# EasyEDA Pro project 1-12.eprj, board PCB2
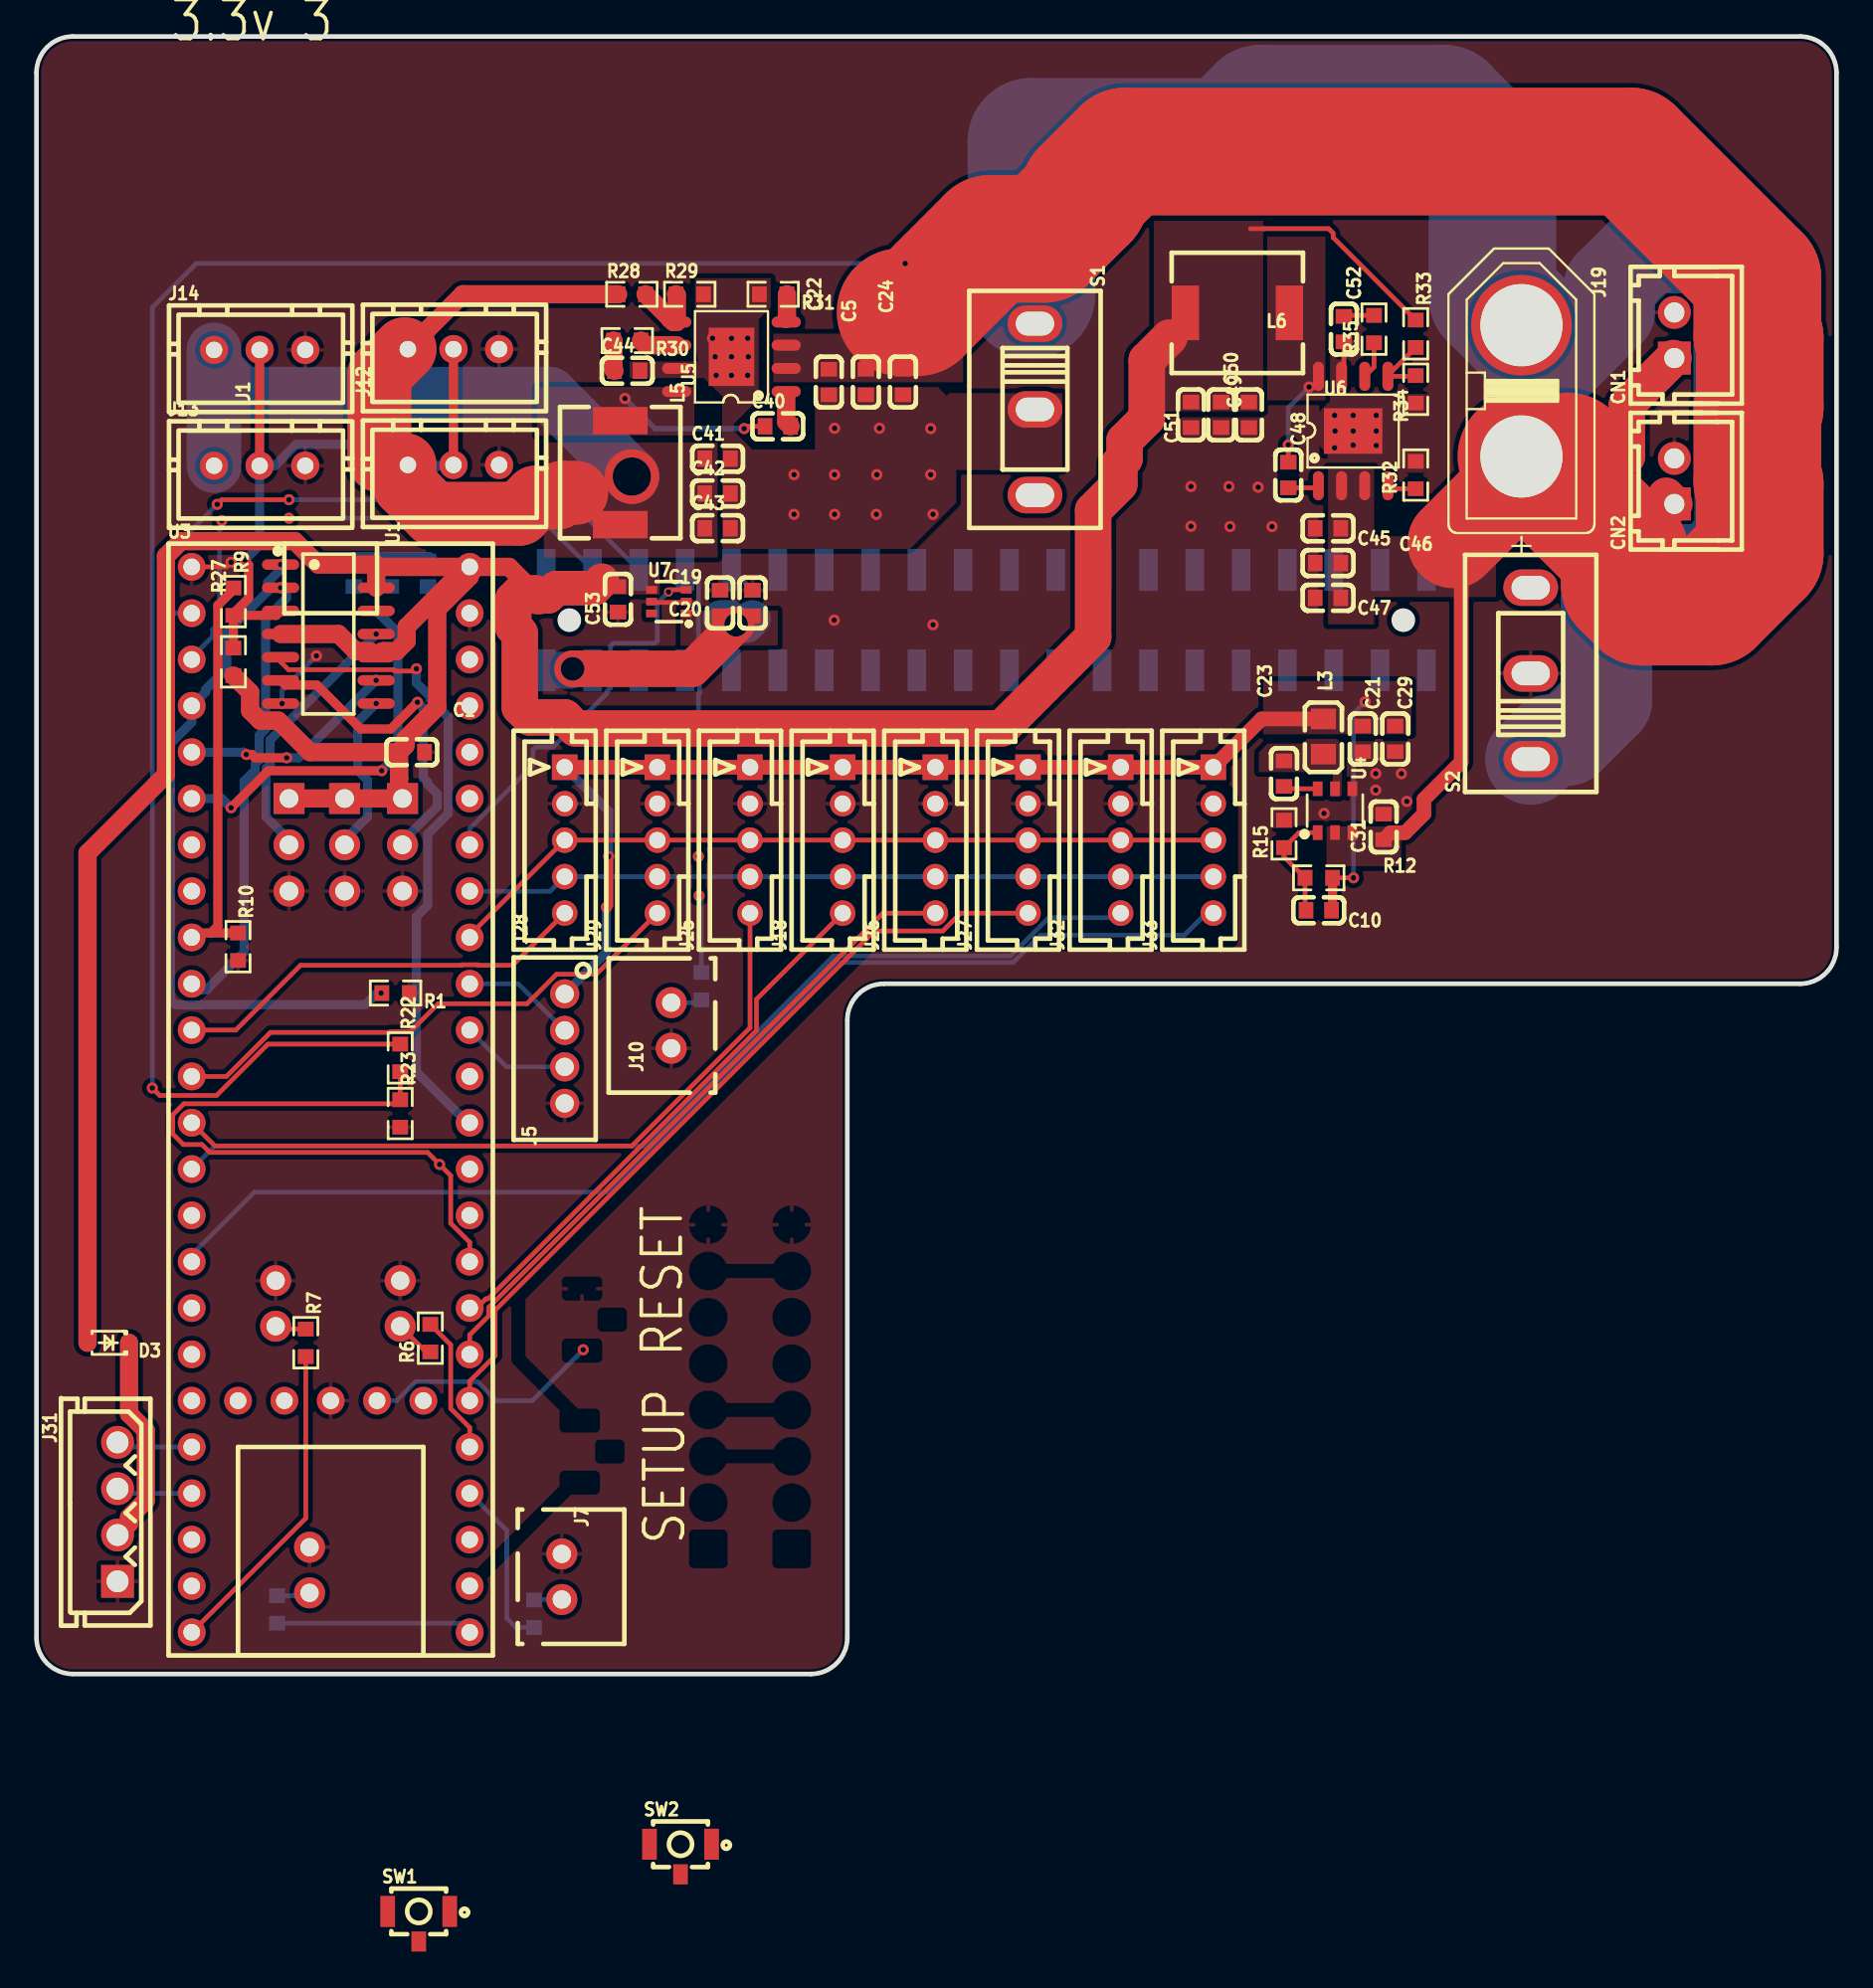
[diagram p1: board, top side]
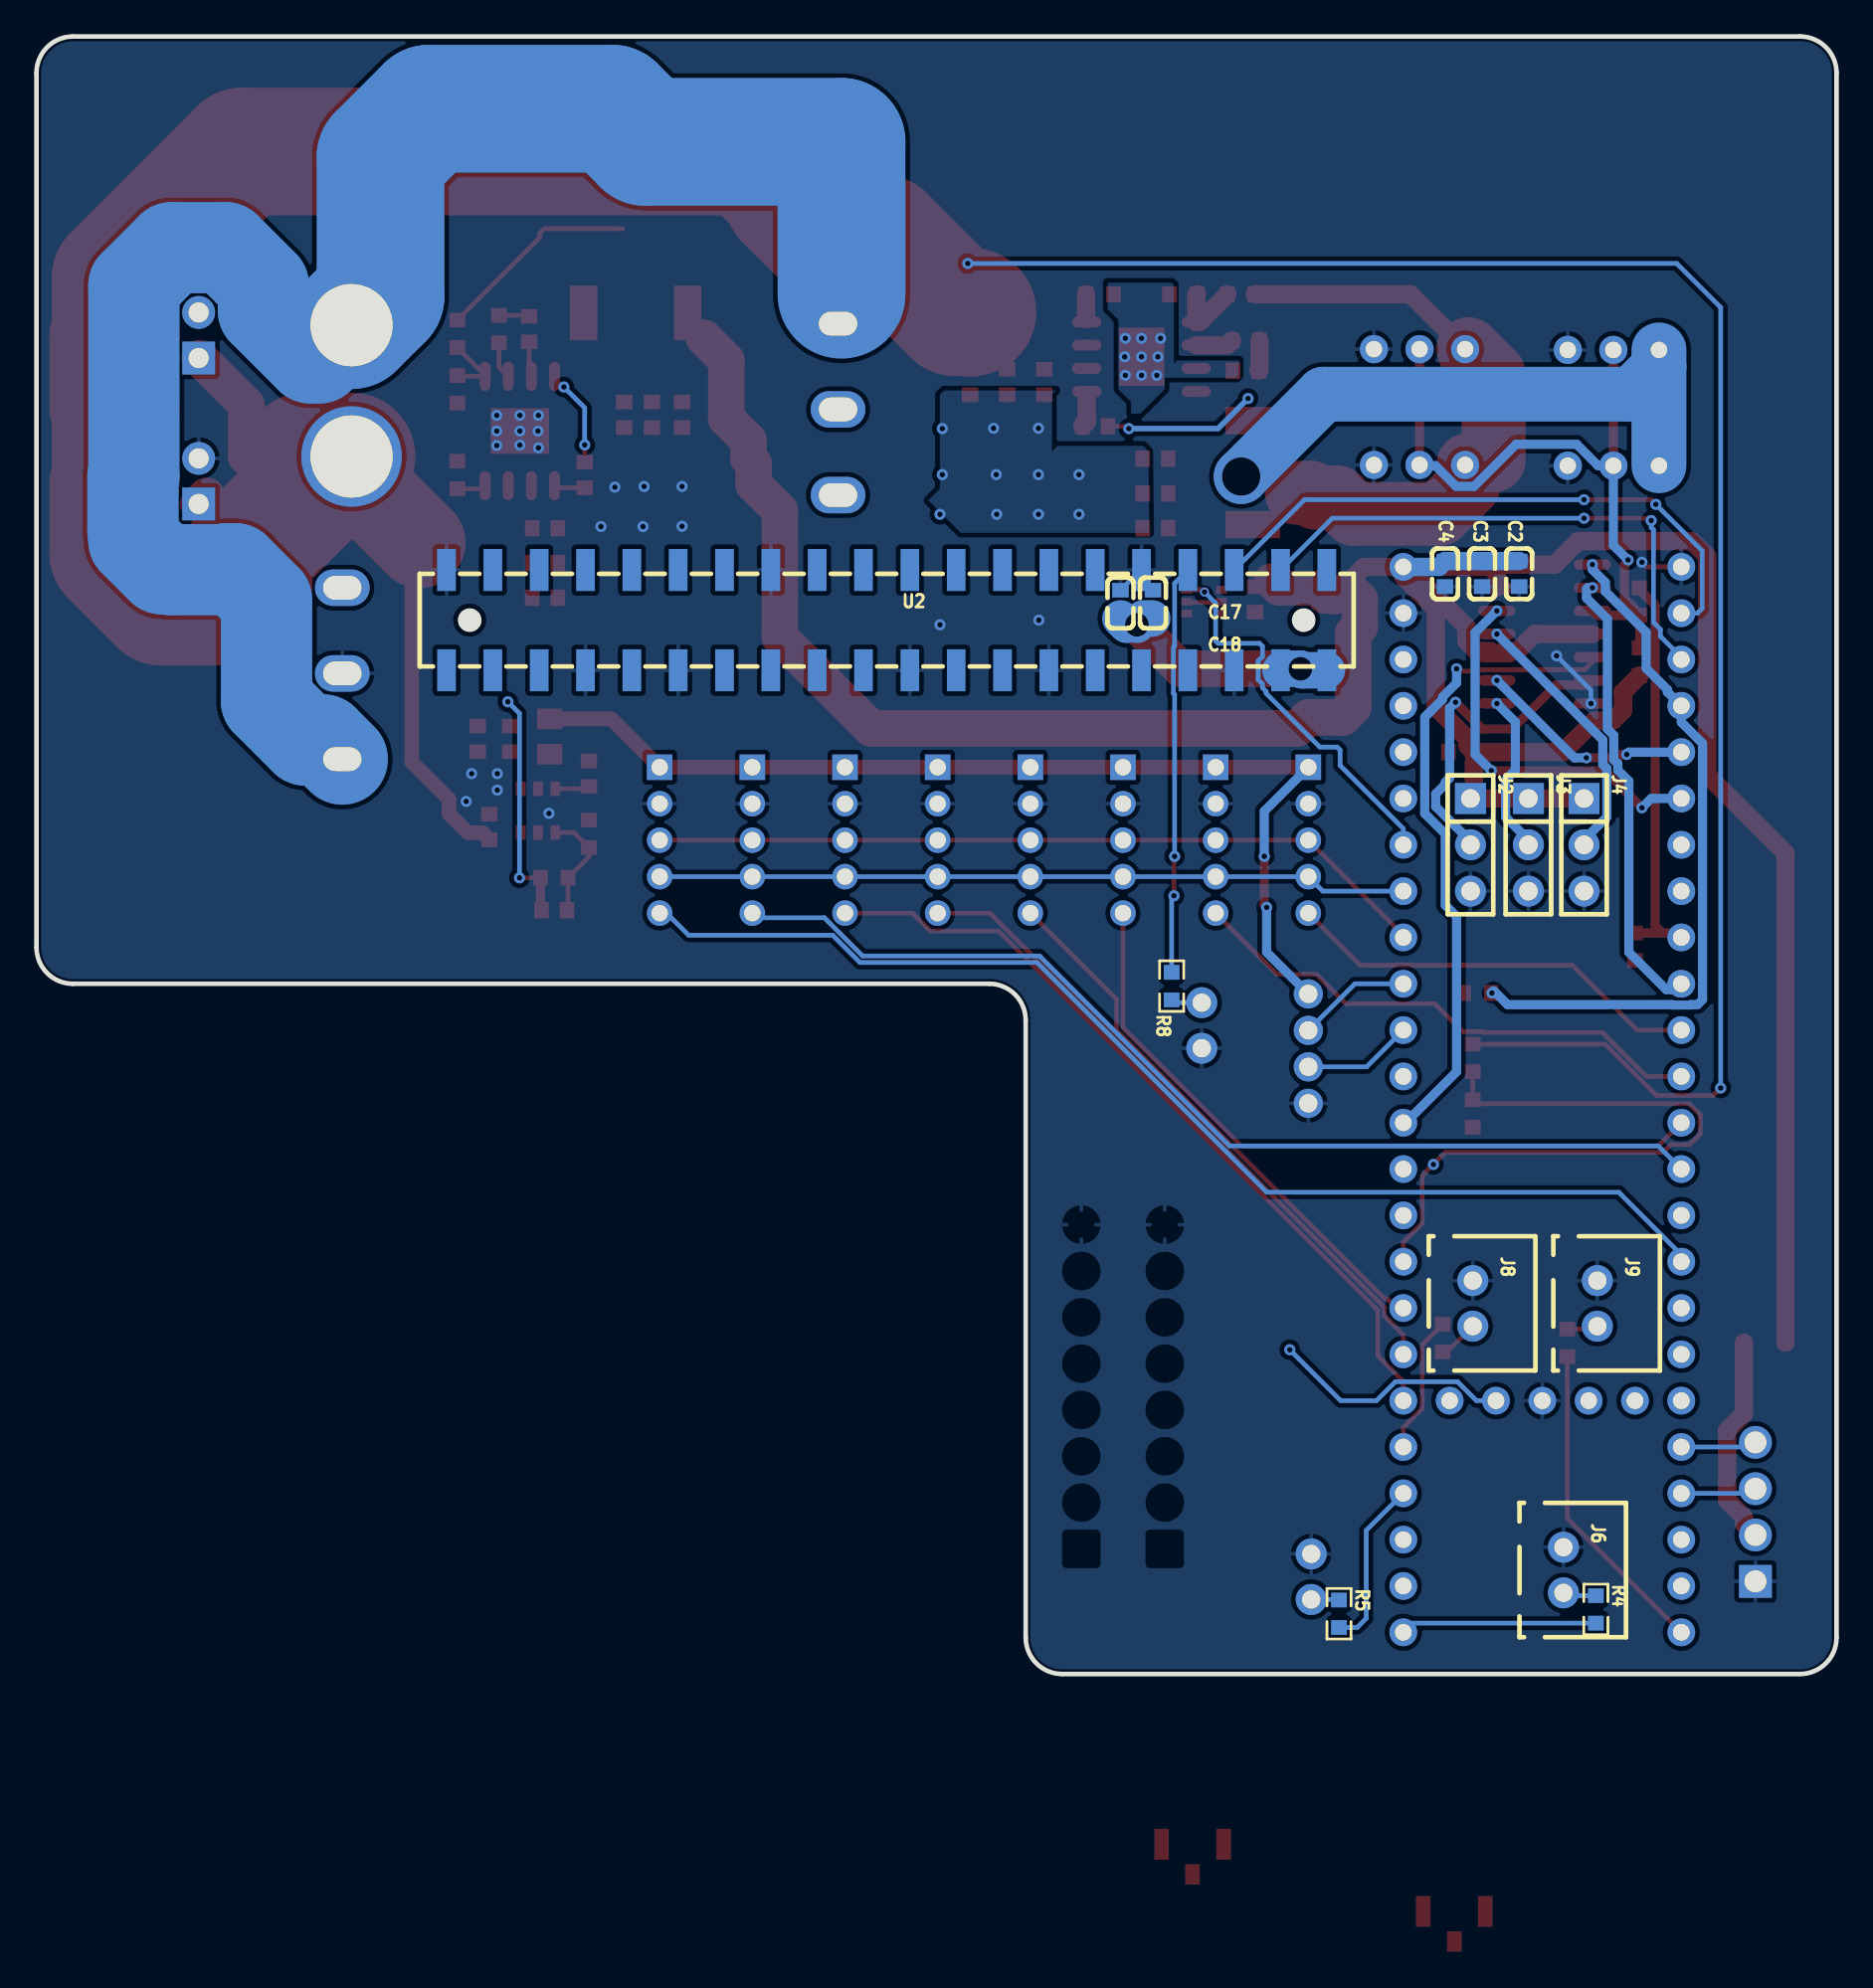
[diagram p2: board, bottom side, seen from below]

Outline 98.68 x 89.79 mm; copper layers: Top Layer, Bottom Layer. Coordinates in mm from the lower left corner of the outline.
Outline path: 0,87.79 0,2 arc(0.59,0.59) 2,0 42.45,0 arc(43.86,0.59) 44.45,2 44.45,35.85 arc(45.04,37.26) 46.45,37.85 96.68,37.85 arc(98.09,38.43) 98.68,39.85 98.68,87.79 arc(98.09,89.2) 96.68,89.79 2,89.79 arc(0.59,89.2) 0,87.79
Stack: Top Layer 0.035mm / Dielectric1 1.51mm FR4 er 4.5 / Bottom Layer 0.035mm

## Design rules (mm)
template: Custom Config
spacing copperThickness1oz (default): track to track 0.102, other pairs 0.152 to 0.3
spacing copperThickness2oz: track to track 0.203, other pairs 0.152 to 0.3
track width copperThickness1oz (default): min 0.127, default 0.254, max 7
track width copperThickness2oz: min 0.203, default 0.254, max 7
differential pair differentialPair (default): width min 0.127, default 0.254, max 2.54; gap min 0.152, default 0.152
via viaSize (default): diameter min 0.5, default 0.61, max 10; hole min 0.3, default 0.305, max 6.3

## Placement (name value [footprint] x y rotation side)
C1  100nF  [C0603]  20.57 50.55 180 top
C2  22uF  [C0603]  17.4 60.33 270 bottom
C3  1uF  [C0603]  19.43 60.33 270 bottom
C4  100nF  [C0603]  21.46 60.33 270 bottom
C5  10uF  [C0603]  45.47 70.84 270 top
C10  100pF  [C0603]  70.3 41.88 180 top
C17  100nF  [C0603]  37.47 58.73 90 bottom
C18  1uF  [C0603]  39.25 58.73 90 bottom
C19  22uF  [C0603]  37.47 58.73 90 top
C20  47uF  [C0603]  39.25 58.73 90 top
C21  22uF  [C0603]  72.71 51.28 270 top
C22  10uF  [C0603]  43.43 70.84 270 top
C23  100nF  [C0603]  68.39 49.37 270 top
C24  100nF  [C0603]  47.5 70.84 270 top
C29  22uF  [C0603]  74.49 51.28 270 top
C31  10uF  [C0603]  73.85 46.45 90 top
C40  100nF  [C0603]  40.64 68.41 0 top
C41  22uF  [C0603]  37.34 66.64 0 top
C42  22uF  [C0603]  37.34 64.73 0 top
C43  22uF  [C0603]  37.34 62.83 0 top
C44  2.7nF  [C0603]  32.39 71.46 0 top
C45  10uF  [C0603]  70.8 62.82 180 top
C46  10uF  [C0603]  70.8 60.92 180 top
C47  100nF  [C0603]  70.8 59.01 180 top
C48  100nF  [C0603]  68.62 65.74 270 top
C49  22uF  [C0603]  66.47 69.04 270 top
C50  22uF  [C0603]  64.94 69.04 270 top
C51  22uF  [C0603]  63.29 69.04 270 top
C52  2.7nF  [C0603]  71.67 73.74 270 top
C53  4.7uF  [C0603]  31.88 58.93 90 top
CN1  ZX-XH2.54-2PZZ  [CONN-TH_2P-P2.50_HX25003-2A]  89.79 73.41 90 top
CN2  ZX-XH2.54-2PZZ  [CONN-TH_2P-P2.50_HX25003-2A]  89.79 65.41 90 top
D3  BAT60B  [SOD-323_L1.7-W1.3-LS2.6-RD-1]  3.94 18.16 180 top
J1  B3B-XH-A(LF)(SN)  [CONN-TH_3P-P2.50_A2501WV2-3P]  22.86 72.64 0 top
J2  PZ254V-11-03P  [HDR-TH_3P-P2.54-V-M_PZ254V-11-03P]  20.07 45.47 270 bottom
J3  PZ254V-11-03P  [HDR-TH_3P-P2.54-V-M_PZ254V-11-03P]  16.89 45.47 270 bottom
J4  PZ254V-11-03P  [HDR-TH_3P-P2.54-V-M_PZ254V-11-03P]  13.84 45.47 270 bottom
J5  B4B-PH-K-S(LF)(SN)  [CONN-TH_B4B-PH-K-S]  28.96 34.29 90 top
J6  B2B-XH-A(LF)(SN)  [CONN-TH_B2B-XH-A-LF-SN]  14.97 5.7 270 bottom
J7  B2B-XH-A(LF)(SN)  [CONN-TH_B2B-XH-A-LF-SN]  28.8 5.33 270 top
J8  B2B-XH-A(LF)(SN)  [CONN-TH_B2B-XH-A-LF-SN]  19.94 20.32 270 bottom
J9  B2B-XH-A(LF)(SN)  [CONN-TH_B2B-XH-A-LF-SN]  13.11 20.32 270 bottom
J10  B2B-XH-A(LF)(SN)  [CONN-TH_B2B-XH-A-LF-SN]  34.8 35.56 90 top
J12  B3B-XH-A(LF)(SN)  [CONN-TH_3P-P2.50_A2501WV2-3P]  22.86 66.29 0 top
J13  B3B-XH-A(LF)(SN)  [CONN-TH_3P-P2.50_A2501WV2-3P]  12.23 66.25 0 top
J14  B3B-XH-A(LF)(SN)  [CONN-TH_3P-P2.50_A2501WV2-3P]  12.23 72.6 0 top
J18  B5B-PH-K-S(LF)(SN)  [CONN-TH_B5B-PH-K-S-LF-SN]  44.2 45.72 90 top
J19  XT60-F  [CONN-TH_XT60PB-F]  81.41 70.36 270 top
J25  B5B-PH-K-S(LF)(SN)  [CONN-TH_B5B-PH-K-S-LF-SN]  39.12 45.72 90 top
J26  B5B-PH-K-S(LF)(SN)  [CONN-TH_B5B-PH-K-S-LF-SN]  49.28 45.72 90 top
J27  B5B-PH-K-S(LF)(SN)  [CONN-TH_B5B-PH-K-S-LF-SN]  54.36 45.72 90 top
J28  B5B-PH-K-S(LF)(SN)  [CONN-TH_B5B-PH-K-S-LF-SN]  28.96 45.72 90 top
J29  B5B-PH-K-S(LF)(SN)  [CONN-TH_B5B-PH-K-S-LF-SN]  34.04 45.72 90 top
J31  22035045  [CONN-TH_22035045]  4.44 8.89 270 top
J32  B5B-PH-K-S(LF)(SN)  [CONN-TH_B5B-PH-K-S-LF-SN]  59.44 45.72 90 top
J33  B5B-PH-K-S(LF)(SN)  [CONN-TH_B5B-PH-K-S-LF-SN]  64.52 45.72 90 top
L3  6.8uH  [L0805]  70.55 51.4 90 top
L5  3.3uH  [IND-SMD_CYA0650-3.3UH]  32 65.87 270 top
L6  3.3uH  [IND-SMD_CYA0650-3.3UH]  65.83 74.63 180 top
R1  10kΩ  [R0603]  19.68 37.34 180 top
R4  1kΩ  [R0603]  13.19 3.54 270 bottom
R5  1kΩ  [R0603]  27.27 3.3 270 bottom
R6  1kΩ  [R0603]  21.59 18.42 90 top
R7  1kΩ  [R0603]  14.76 18.16 270 top
R8  1kΩ  [R0603]  36.45 37.72 90 bottom
R9  3.3kΩ  [R0603]  10.79 58.8 270 top
R10  4.7kΩ  [R0603]  11.05 39.88 270 top
R12  196kΩ  [R0603]  70.3 43.66 180 top
R15  62kΩ  [R0603]  68.39 46.07 90 top
R22  3.3kΩ  [R0603]  19.94 33.78 270 top
R23  4.7kΩ  [R0603]  19.94 30.73 270 top
R27  2.2kΩ  [R0603]  10.79 55.5 270 top
R28  115kΩ  [R0603]  32.64 75.65 0 top
R29  22.1kΩ  [R0603]  35.81 75.65 0 top
R30  15.8kΩ  [R0603]  32.39 73.11 180 top
R31  200kΩ  [R0603]  40.39 75.65 180 top
R32  200kΩ  [R0603]  75.61 65.74 90 top
R33  115kΩ  [R0603]  75.61 73.49 270 top
R34  22.1kΩ  [R0603]  75.61 70.44 270 top
R35  15.8kΩ  [R0603]  73.32 73.74 90 top
S1  SS-12M11G4  [SW-TH_XKB_SS-12M11XX]  54.74 69.34 270 top
S2  SS-12M11G4  [SW-TH_XKB_SS-12M11XX]  81.92 54.86 90 top
SW1  B3U-1100PM  [SW-SMD_3P-L3.0-W2.5-LS4.0]  20.95 -13.84 0 top
SW2  B3U-1100PM  [SW-SMD_3P-L3.0-W2.5-LS4.0]  35.31 -10.16 0 top
U1  CD74HCT126M96  [SOIC-14_L8.7-W3.9-P1.27-LS6.0-BL]  16 57.02 270 top
U2  FH-00148  [HDR-SMD_40P-P2.54-V-F-R2-C20-S7.1-EH]  52.07 57.79 0 bottom
U3  -  [TEENSY 4.1]  16.13 30.35 0 top
U4  AP63201WU-7  [TSOT-23-6_L2.9-W1.6-P0.95-LS2.8-BR]  71.18 47.34 270 top
U5  AP64500SP-13  [SO-8_L4.9-W3.9-P1.27-LS6.0-BL-EP]  38.1 72.22 90 top
U6  AP64500SP-13  [SO-8_L4.9-W3.9-P1.27-LS6.0-BL-EP]  72.18 68.16 0 top
U7  SIP32411DR-T1-GE3  [SC-70-6_L2.1-W1.3-P0.65-LS2.1-BR]  34.67 58.8 0 top

## Footprints (pads in the part's own frame, mm; a bottom-side part is the same pattern mirrored in y, then rotated)
C0603
  rect 0.8x0.9 smd: 1(-0.7,0) 2(0.7,0)
CONN-TH_2P-P2.50_HX25003-2A
  rect 1.8x1.8 hole 1.1: 1(-1.25,0)
  round 1.8 hole 1.1: 2(1.25,0)
CONN-TH_3P-P2.50_A2501WV2-3P
  round 1.55 hole 0.9: 1(-2.5,0) 2(0,0) 3(2.5,0)
CONN-TH_22035045
  rect 1.8x1.8 hole 1.2: 1(3.81,0)
  round 1.8 hole 1.2: 2(1.27,0) 3(-1.27,0) 4(-3.81,0)
CONN-TH_B2B-XH-A-LF-SN
  round 1.7 hole 1: 1(1.25,0) 2(-1.25,0)
CONN-TH_B4B-PH-K-S
  round 1.6 hole 1: 1(3,0) 2(1,0) 3(-1,0) 4(-3,0)
CONN-TH_B5B-PH-K-S-LF-SN
  rect 1.4x1.4 hole 0.9: 1(4,0)
  round 1.4 hole 0.9: 2(2,0) 3(0,0) 4(-2,0) 5(-4,0)
CONN-TH_XT60PB-F
  round 5.516 hole 4.505x4.5: +(3.6,0) -(-3.6,0)
HDR-SMD_40P-P2.54-V-F-R2-C20-S7.1-EH
  rect 1.02x2.3 smd: 1(-24.13,-2.75) 2(-24.13,2.75) 3(-21.59,-2.75) 4(-21.59,2.75) 5(-19.05,-2.75) 6(-19.05,2.75) 7(-16.51,-2.75) 8(-16.51,2.75) 9(-13.97,-2.75) 10(-13.97,2.75) 11(-11.43,-2.75) 12(-11.43,2.75) 13(-8.89,-2.75) 14(-8.89,2.75) 15(-6.35,-2.75) 16(-6.35,2.75) 17(-3.81,-2.75) 18(-3.81,2.75) 19(-1.27,-2.75) 20(-1.27,2.75) 21(1.27,-2.75) 22(1.27,2.75) 23(3.81,-2.75) 24(3.81,2.75) 25(6.35,-2.75) 26(6.35,2.75) 27(8.89,-2.75) 28(8.89,2.75) 29(11.43,-2.75) 30(11.43,2.75) 31(13.97,-2.75) 32(13.97,2.75) 33(16.51,-2.75) 34(16.51,2.75) 35(19.05,-2.75) 36(19.05,2.75) 37(21.59,-2.75) 38(21.59,2.75) 39(24.13,-2.75) 40(24.13,2.75)
HDR-TH_3P-P2.54-V-M_PZ254V-11-03P
  rect 1.7x1.7 hole 1.02: 1(-2.54,0)
  round 1.7 hole 1.02: 2(0,0) 3(2.54,0)
IND-SMD_CYA0650-3.3UH
  rect 1.5x3 smd: 1(-2.85,0) 2(2.85,0)
L0805
  rect 1.133x1.377 smd: 1(-0.966,0) 2(0.966,0)
R0603
  rect 0.806x0.864 smd: 1(-0.753,0) 2(0.753,0)
SC-70-6_L2.1-W1.3-P0.65-LS2.1-BR
  rect 0.6x0.42 smd: 1(0.95,-0.65) 2(0.95,0) 3(0.95,0.65) 4(-0.95,0.65) 5(-0.95,0) 6(-0.95,-0.65)
SO-8_L4.9-W3.9-P1.27-LS6.0-BL-EP
  oval 0.6x1.6 smd: 1(-1.905,-3) 2(-0.635,-3) 3(0.635,-3) 4(1.905,-3) 5(1.905,3) 6(0.635,3) 7(-0.635,3) 8(-1.905,3)
  rect 3.2x2.5 smd: 9(0,0)
SOD-323_L1.7-W1.3-LS2.6-RD-1
  rect 0.83x0.63 smd: 1(-1.14,0) 2(1.14,0)
SOIC-14_L8.7-W3.9-P1.27-LS6.0-BL
  oval 0.574x2.038 smd: 1(-3.81,-2.619) 2(-2.54,-2.619) 3(-1.27,-2.619) 4(0,-2.619) 5(1.27,-2.619) 6(2.54,-2.619) 7(3.81,-2.619) 8(3.81,2.619) 9(2.54,2.619) 10(1.27,2.619) 11(0,2.619) 12(-1.27,2.619) 13(-2.54,2.619) 14(-3.81,2.619)
SW-SMD_3P-L3.0-W2.5-LS4.0
  rect 0.8x1.7 smd: 1(1.7,0.825) 2(-1.7,0.825)
  rect 0.8x1.1 smd: 3(0,-0.825)
SW-TH_XKB_SS-12M11XX
  oval 2x3 hole 1.3x2.1: 1(-4.7,0) 2(0,0) 3(4.7,0)
TEENSY 4.1
  round 1.524 hole 0.914: 1(-7.62,30.353) 2(-7.62,27.813) 3(-7.62,25.273) 4(-7.62,22.733) 5(-7.62,20.193) 6(-7.62,17.653) 7(-7.62,15.113) 8(-7.62,12.573) 9(-7.62,10.033) 10(-7.62,7.493) 11(-7.62,4.953) 12(-7.62,2.413) 13(-7.62,-0.127) 14(-7.62,-2.667) 15(-7.62,-5.207) 16(-7.62,-7.747) 17(-7.62,-10.287) 18(-7.62,-12.827) 19(-7.62,-15.367) 20(-7.62,-17.907) 21(-7.62,-20.447) 22(-7.62,-22.987) 23(-7.62,-25.527) 24(-7.62,-28.067) 25(7.62,30.353) 26(7.62,27.813) 27(7.62,25.273) 28(7.62,22.733) 29(7.62,20.193) 30(7.62,17.653) 31(7.62,15.113) 32(7.62,12.573) 33(7.62,10.033) 34(7.62,7.493) 35(7.62,4.953) 36(7.62,2.413) 37(7.62,-0.127) 38(7.62,-2.667) 39(7.62,-5.207) 40(7.62,-7.747) 41(7.62,-10.287) 42(7.62,-12.827) 43(7.62,-15.367) 44(7.62,-17.907) 45(7.62,-20.447) 46(7.62,-22.987) 47(7.62,-25.527) 48(7.62,-28.067) 49(5.08,-15.367) 50(2.54,-15.367) 51(0,-15.367) 52(-2.54,-15.367) 53(-5.08,-15.367)
TSOT-23-6_L2.9-W1.6-P0.95-LS2.8-BR
  rect 0.8x0.532 smd: 1(1.2,-0.95) 2(1.2,0) 3(1.2,0.95) 4(-1.2,0.95) 5(-1.2,0) 6(-1.2,-0.95)

## Nets
As in the schematic, except:
POWER_GND: C1.1 C2.2 C3.2 C4.2 C17.2 C18.2 C19.2 C20.2 C21.2 C29.2 C31.2 C45.2 C46.2 C47.2 C49.2 C50.2 C51.2 C52.2 C53.1 CN1.2 CN2.2 J1.3 J2.3 J3.3 J4.3 J5.4 J6.2 J7.2 J8.2 J9.2 J10.2 J12.3 J13.3 J14.3 J18.2 J25.2 J26.2 J27.2 J28.2 J29.2 J31.1 J32.2 J33.2 R1.1 R10.2 R15.2 R23.2 R32.2 R34.2 S2.2 SW1.1 SW2.1 U1.7 U2.6 U2.9 U2.14 U2.20 U2.25 U2.30 U2.34 U2.39 U3.1 U3.26 U3.51 U4.4 U6.7 U6.9 U7.2 U7.5
TEENSY_RX7: J31.4 U3.20
TEENSY_TX7: J31.3 U3.21
$1N12657: D3.1 J31.2

Pads without a net: S1 3; S2 3; SW1 3; SW2 3; U2 1 8 10 11 12 13 15 16 17 18 19 21 22 23 24 26 27 28 29 31 32 33 35 36 37 38 40; U3 7 8 15 17 18 19 22 23 27 28 29 30 36 38 39 46 49 52 53; U7 6

## Via types
v1: diameter 2, hole 1.3, Top Layer to Bottom Layer, 2 vias
v2: diameter 0.61, hole 0.305, Top Layer to Bottom Layer, 77 vias
v3: diameter 0.5, hole 0.305, Top Layer to Bottom Layer, 1 via
v4: diameter 3, hole 2.1, Top Layer to Bottom Layer, 1 via

## Routing (per net, layer and track width the routed paths; a pad name or vN(x,y) marks a point on that pad's centre or on a via; arc(x,y) is an arc through that point)
+3.3V: length 14.4
  Top Layer w0.5: v2(31.24,42.04) 31.37,42.16 v2(31.37,44.83)
  Bottom Layer w0.5: J5.1 31.24,39.58 v2(31.24,42.04) ; v2(31.37,44.83) 31.37,47.31 J28.1
+5V: length 193.5
  Top Layer w0.254: R33.1 71.08,78.77 71.08,79 70.83,79.25 67.29,79.25 67.29,79.25 66.55,79.25
  Top Layer w1: 18.93,56.07 19.02,56.07 19.04,56.08 19.74,56.08 20.29,56.63 20.29,57.42 23.57,60.71 18.75,60.71 U1.14 ; U1.14 15.44,60.83 14.16,62.12 7.92,62.12 7.09,61.29 7.09,49.31 2.8,45.01 D3.2 ; U1.14 U1.13 ; J4.1 J3.1 J2.1 19.87,48.2 19.87,49.13 19.88,49.13 19.88,49.93 19.87,49.93 C1.2 ; R27.2 11.71,53.83 11.71,52.82 12.26,52.27 13.27,52.27 14.99,50.55 C1.2 ; 27.36,59.25 25.91,60.71 U3.25 23.75,60.17 21.97,58.39 21.97,53.02 20.22,51.27 20.22,50.89 C1.2 ; U1.4 16.56,57.02 17.5,56.08 18.29,56.08
  Top Layer w1.9: 30.99,59.94 30.58,59.54 28.48,59.54 28.04,59.09 27.52,59.09
  Top Layer w2: 62.1,73.28 60.86,72.04 60.86,68.85 59.65,67.63 59.65,66.65 59.36,66.36 59.36,65.24 57.93,63.8 57.93,56.87 52.91,51.85 29.56,51.85 28.96,52.45 27.05,52.45 26.49,53.01 26.49,57.06 26.14,57.42 26.14,58.91 26.47,59.25 27.36,59.25 27.52,59.09
  Bottom Layer w1: C2.1 C3.1 C4.1 21.78,60.71 U3.25
+5VM: length 62.8
  Top Layer w1: R28.1 23.37,75.65 J1.1
  Top Layer w3.5: 20.18,72.64 18.8,71.26 18.8,66.55 ; 20.18,66.29 20.18,65.19 21.75,63.62 26.47,63.62 27.36,64.51 28.56,64.51 28.83,64.77 29.59,64.77
  Bottom Layer w3: 9.73,71.67 J14.1 ; 9.73,71.67 J13.1 ; 9.73,71.67 11.23,70.18 28.12,70.18 v4(32.64,65.66)
+BATT: length 222.4
  Top Layer w0.254: R22.1 12.69,34.54 9.88,31.73 6.76,31.73 v2(6.35,32.13)
  Top Layer w0.8: 78.11,61.6 78.11,50 76.06,47.96 76.06,47.16 75.03,46.13 74.23,46.13 C31.1
  Top Layer w2: 83.94,66.76 87.19,66.76 87.19,69.6 89.74,72.16 ; CN2.1 89.34,64.6
  Top Layer w5: 77.66,62.04 81.41,65.79 81.41,66.76
  Top Layer w7: 47.37,74.68 48.29,74.68 52.31,78.69 55.21,78.69 57.46,80.94 57.46,81.25 59.68,83.48 87.4,83.48 94.34,76.54 94.34,73.37 94.47,73.24 94.47,69.47 94.34,69.34 94.34,65.37 94.47,65.24 94.47,61.47 91.8,58.8 88.03,58.8 87.07,59.76 87.07,61.49 83.94,64.62 83.94,66.76 ; 81.41,66.76 82.99,66.76
  Bottom Layer w0.254: v2(6.35,32.13) 6.35,74.93 8.76,77.34 v2(47.62,77.34)
BATT_READ: length 36.7
  Top Layer w0.254: U3.40 23.75,23.67 22.71,24.72 22.71,27.33 v2(22.1,27.94) 21.44,28.6 9.5,28.6 9.07,29.03 8.05,29.03 7.47,29.62 7.47,30.66 8.08,31.27 19.72,31.27 R23.1 R22.2
HS45HB-0_SIGNAL: length 8.9
  Bottom Layer w0.5: J3.2 16.89,45.74 18.14,46.99 18.14,49.02 17.6,49.56 17.6,52.2 v2(18.62,53.21)
HS45HB-1_SIGNAL: length 14.6
  Bottom Layer w0.5: J4.2 13.84,45.74 12.59,46.99 12.59,49.66 12.81,49.88 12.81,51.21 v2(18.62,57.02)
K230D_PIN_7: length 22.5
  Top Layer w0.254: v2(36.32,42.67) 36.32,44.7 36.2,44.83
  Bottom Layer w0.254: R8.2 36.45,42.55 v2(36.32,42.67) ; U2.7 36.29,59.81 36.29,56.36 36.35,56.3 36.35,53.77 36.29,53.71 v2(36.29,44.83)
K230RX: length 29.9
  Top Layer w0.254: v2(10.16,63.25) 10.29,63.37 v2(13.84,63.37)
  Bottom Layer w0.254: v2(10.16,63.25) 10.16,62.87 10.03,62.74 10.03,57.66 9.65,57.28 9.65,56.9 8.64,55.88 8.64,55.75 8.51,55.63 ; v2(13.84,63.37) 27.64,63.37 U2.3
K230TX: length 32.8
  Top Layer w0.254: v2(13.84,64.39) 10.16,64.39 v2(9.91,64.14)
  Bottom Layer w0.254: U2.5 29.17,64.39 v2(13.84,64.39) ; v2(9.91,64.14) 7.37,61.6 7.37,58.42 7.62,58.17 8.51,58.17
KRS3301_SIGNAL: length 18.3
  Top Layer w0.5: v2(20.89,53.28) 19.42,51.82 17.78,51.82 15.37,54.23 13.64,54.23 U1.6
  Bottom Layer w0.5: v2(20.89,53.28) 21.21,52.96 21.21,49.13 21.44,48.9 21.44,48.79 21.97,48.26 21.97,47.56 20.19,45.78 20.19,45.59 J2.2
MGND:
  vias: v2(37.06,73.24) v2(37.2,72.22) v2(37.26,71.21) v2(38.1,73.24) v2(38.1,72.22) v2(38.1,71.21) v2(38.99,73.24) v2(39.02,72.22) v2(38.99,71.21) v2(41.53,65.76) v2(41.53,63.59) v2(43.75,68.3) v2(43.75,65.76) v2(43.75,63.59) v2(46.07,65.76) v2(46.04,63.59) v2(46.21,68.3) v2(49.02,68.29) v2(49.02,65.76) v2(49.15,63.59)
POWER_GND: length 68
  Top Layer w0.254: 8.51,60.71 10.41,60.71 v2(10.67,60.96) ; 71.05,43.66 v2(72.2,43.66) ; 33.72,58.76 35.58,58.76 U7.2 ; U6.7 71.67,71.28 C52.2
  Top Layer w0.5: 71.05,43.66 71.05,41.93
  Top Layer w0.8: 70.55,52.37 67.16,52.37 64.52,49.72 28.96,49.72
  Bottom Layer w0.254: C19.2 38.1,60.05 U2.9 38.14,60.54 C20.2 ; v2(15.35,55.83) 13.46,53.95 v2(13.46,53.21) ; v2(72.84,53.31) 72.2,52.67 v2(72.2,43.66)
  vias: v2(43.73,57.79) v2(49.15,57.53) v2(63.29,65.11) v2(63.29,62.93) v2(65.37,65.11) v2(65.43,62.92) v2(66.97,65.08) v2(67.73,62.92) v2(70.59,47.19) v2(71.16,69.01) v2(71.19,68.16) v2(71.16,67.23) v2(72.18,69.01) v2(72.18,68.16) v2(72.18,67.38) v2(73.42,49.37) v2(73.42,48.47) v2(73.45,69.01) v2(73.45,68.16) v2(73.45,67.36) v2(74.82,49.37) v2(75.12,47.85)
RESET: length 13.3
  Bottom Layer w0.254: v2(29.97,17.78) 27.18,14.99 25.22,14.99 24.18,16.03 20.78,16.03 19.74,14.99 U3.50
STS3032_SIGNAL: length 38.7
  Top Layer w0.5: J12.2 J1.2 ; U1.3 13.14,58.05 R9.2 ; J13.2 J14.2 ; R27.1 R9.2 ; R9.2 10.79,58.15 11.63,58.98 11.63,60.82 11.43,61.01 v2(11.43,61.09)
  Bottom Layer w0.5: v2(11.43,61.09) 12.23,61.89 J13.2 13.07,66.25 14.25,67.43 17.56,67.43 19.87,65.12 20.85,65.12 21.98,66.25 22.82,66.25 J12.2
TEENSY30: length 38.3
  Bottom Layer w0.5: v2(13.38,60.83) 13.38,60.56 12.68,59.86 12.68,59.36 10.43,57.12 10.43,55.14 9.27,53.98 9.27,53.85 8.51,53.09 8.51,52.19 7.34,51.03 7.34,36.98 7.62,36.7 8.01,36.7 8.03,36.68 8.99,36.68 9.01,36.7 18.03,36.7 18.8,37.47
  vias: v2(18.89,37.34)
TEENSY_3: length 12
  Top Layer w0.5: v2(11.5,50.42) 11.81,50.42 11.99,50.24 v2(13.72,50.24)
  Bottom Layer w0.5: v2(13.72,50.24) 14.38,50.24 v2(18.62,54.48) ; v2(11.5,50.42) 11.38,50.55 8.51,50.55
TEENSY_4: length 21.1
  Top Layer w0.5: v2(18.92,49.53) 12.7,49.53 v2(10.67,47.5)
  Bottom Layer w0.5: 8.51,48.01 10.16,48.01 v2(10.67,47.5) ; v2(18.62,58.29) 19.81,57.1 19.81,50.42 v2(18.92,49.53)
TEENSY_9: length 23.1
  Top Layer w0.254: J28.5 26.1,38.86 24.2,38.86 24.18,38.89 23.32,38.89 23.29,38.86 14.48,38.86 10.92,35.31 8.51,35.31
TEENSY_10: length 29.2
  Top Layer w0.254: J29.5 30.68,38.37 28.51,38.37 26.89,36.75 22.02,36.75 20.49,35.22 19.39,35.22 19.35,35.18 12.83,35.18 10.41,32.77 8.51,32.77
TEENSY_11: length 40.1
  Top Layer w0.254: 8.51,30.23 9.78,28.96 32.64,28.96 39.12,35.43 J25.5
TEENSY_12: length 56.7
  Bottom Layer w0.254: 8.51,27.69 9.78,28.96 33.27,28.96 43.69,39.37 53.39,39.37 55.49,41.47 59.18,41.47 J32.5
TEENSY_24: length 64.1
  Bottom Layer w0.254: J33.5 64.14,41.72 62.93,40.51 55.04,40.51 53.54,39.01 43.84,39.01 31.24,26.42 11.94,26.42 8.51,22.99 8.51,22.61
TEENSY_32: length 17.7
  Top Layer w0.254: R7.2 14.76,8.54 8.51,2.29
TEENSY_33: length 10.8
  Bottom Layer w0.254: U3.48 23.25,2.79 R4.2
TEENSY_36: length 9.4
  Bottom Layer w0.254: R5.2 26.28,2.55 25.78,3.05 25.78,7.87 U3.45
TEENSY_37: length 7.6
  Top Layer w0.254: U3.44 23.75,13.51 22.71,14.56 22.71,18.05 R6.2
TEENSY_38: length 43.8
  Top Layer w0.254: U3.43 23.75,16.05 25.15,17.45 25.15,19.95 45.93,40.74 49.68,40.74 50.66,41.72 J27.5
TEENSY_39: length 36.4
  Top Layer w0.254: J26.5 46.41,41.72 24.79,20.1 24.79,19.64 23.75,18.59 U3.42
TEENSY_40: length 30.4
  Top Layer w0.254: U3.41 24.13,20.07 24.64,20.57 24.76,20.57 39.47,35.29 39.47,37 J18.5
TEENSY_K230_ENABLE: length 21.5
  Top Layer w0.254: U7.3 34.77,59.45 v3(34.65,59.33)
  Bottom Layer w0.254: U3.31 23.75,46.36 27.21,49.82 27.21,50.66 27.38,50.83 28.33,50.83 31.27,53.77 31.27,53.88 31.47,54.08 31.47,54.29 31.71,54.53 31.71,55.54 31.47,55.78 31.47,56.35 31.63,56.52 33.91,56.52 34.04,56.64 34.04,58.72 v3(34.65,59.33)
TEENSY_RX2: length 22.1
  Top Layer w0.5: R10.1 9.55,40.63 ; 9.55,40.63 8.75,40.63 8.51,40.39 ; 9.55,40.63 9.94,41.02 9.94,58.6 10.79,59.45 R9.1
TEENSY_RX7: length 4.2
  Bottom Layer w0.254: 8.51,12.45 4.7,12.45 J31.4
TEENSY_SCL-0: length 6
  Bottom Layer w0.254: J5.3 25.77,33.29 U3.35
TEENSY_SCL-1: length 41.1
  Bottom Layer w0.254: U3.32 28.16,42.93 J28.4 J29.4 J25.4 J18.4 J26.4 J27.4 J32.4 J33.4
TEENSY_SDA-0: length 6.3
  Bottom Layer w0.254: U3.34 26.4,37.85 J5.2
TEENSY_SDA-1: length 43.1
  Top Layer w0.254: J33.3 J32.3 J27.3 J26.3 J18.3 J25.3 J29.3 J28.3 23.75,40.51 U3.33
TEENSY_TX2: length 25.1
  Bottom Layer w0.5: v2(13.38,59.56) 13.64,59.56 13.7,59.5 13.7,58.99 12.56,57.85 12.56,51.81 12.21,51.46 12.21,50.13 11.99,49.91 11.99,49.56 11.38,48.96 11.38,39.58 9.33,37.53 9.08,37.53 8.76,37.85 8.51,37.85
TEENSY_TX3: length 35.6
  Top Layer w0.254: v2(20.83,55.12) 20.7,54.99 19.65,54.99 19.57,55.07 13.81,55.07 13.38,55.5 U1.5
  Bottom Layer w0.5: v2(20.83,55.12) 20.83,54.34 21.59,53.58 21.59,53.45 22.57,52.47 22.57,47.19 21.44,46.06 21.44,42.15 20.83,41.54 20.83,33.02 23.62,30.23 U3.37
TEENSY_TX7: length 4.2
  Bottom Layer w0.254: 8.51,9.91 4.7,9.91 J31.3
$1N12: length 6.1
  Top Layer w0.254: C10.2 69.54,41.93 R12.2 68.39,44.81 R15.1 69.21,46.14 U4.1
$1N113: length 1.9
  Top Layer w0.254: U4.6 68.52,48.54 C23.2
$1N133: length 95.9
  Bottom Layer w5: S2.1 82.96,51.21 83.93,51.21 86.07,53.35 86.07,58.88 87.79,60.6 88.25,60.6 88.3,60.55 91.28,60.55 91.33,60.6 91.79,60.6 93.34,62.16 93.34,62.61 93.39,62.66 93.39,65.65 93.34,65.7 93.34,76.13 91.26,78.21 88.32,78.21 86.24,76.13 86.24,74.76 83.65,72.17 83.2,72.17 J19.-
  Bottom Layer w7: 54.55,84.01 65.29,84.01 67.11,85.83 77.16,85.83 79.82,83.17 79.82,75.55 J19.- ; 54.55,84.01 54.55,75.63
$1N12541: length 13.6
  Top Layer w2: v1(29.39,55.12) 35.94,55.12 v1(38.35,57.53)
  Bottom Layer w2: 38.01,57.88 37.52,57.88 ; U2.2 29.31,55.04 v1(29.39,55.12) 30.4,55.12 U2.4 ; 38.91,57.53 39.25,57.88
$1N12598: length 1.7
  Bottom Layer w0.254: J10.1 36.29,36.81 R8.1
$1N12604: length 2.2
  Top Layer w0.254: R6.1 21.35,17.66 J8.1
$1N12618: length 1.8
  Bottom Layer w0.254: R4.1 14.81,4.29 J6.1
$1N12632: length 1.7
  Top Layer w0.254: R7.1 13.27,18.91 J9.1
$1N12638: length 1.5
  Bottom Layer w0.254: R5.1 27.3,4.08 J7.1
$1N12657: length 11.6
  Top Layer w1: J31.2 5.08,8.25 5.08,8.6 6,9.52 6,13.34 5.08,14.26 D3.1
$1N35510: length 1.7
  Top Layer w1: 41.1,70.03 41.1,68.65 C40.2
$1N35520: length 8.4
  Top Layer w0.254: v2(38.8,68.29) 38.92,68.41 C40.1
  Bottom Layer w0.3: v2(38.8,68.29) 33.91,68.29 v2(32.26,69.94)
$1N35575: length 3.9
  Top Layer w1: R29.1 35.1,75.61 U5.5 34.92,74.13 R28.2
$1N35837: length 2.1
  Top Layer w1: U5.6 33.39,72.86 R30.1
$1N35914: length 1.7
  Top Layer w1: C44.1 31.63,71.52 R30.2
$1N35993: length 1.4
  Top Layer w1: R31.1 41.14,74.33 41.1,74.29
$1N36774: length 1.7
  Top Layer w0.254: C48.2 70.16,65.04 U6.1
$1N36776: length 4.6
  Top Layer w0.254: 68.62,66.44 v2(68.62,67.39)
  Bottom Layer w0.254: v2(68.62,67.39) 68.62,69.43 v2(69.77,70.57)
$1N36782: length 3.8
  Top Layer w0.254: 75.61,72.74 74.09,71.21 U6.5 75.57,71.16 R34.1
$1N36795: length 2
  Top Layer w0.254: U6.6 73.32,71.66 R35.1
$1N36798: length 1.7
  Top Layer w0.254: R35.2 71.73,74.5 C52.1
$1N36802: length 1.6
  Top Layer w0.254: R32.1 74.25,64.99 U6.4

## Copper pours and planes (outline as drawn; the poured copper is in the pictures)
+5V on Top Layer: 61.26,79.68 67.25,79.68 67.25,69.23 61.26,69.23
+5V on Top Layer: 30.73,60.83 34.16,60.83 34.16,59.18 30.73,59.18
+5VM on Top Layer: 28.32,62.74 34.14,62.74 34.14,61.61 28.32,61.61
+5VM on Top Layer: 27.81,67.53 37.34,67.53 37.34,61.21 27.81,61.21
+BATT on Top Layer: 70.8,66.16 73.33,66.16 73.33,57.55 70.8,57.55
+BATT on Top Layer: 40.39,73.49 50.8,73.49 50.8,70.83 40.39,70.83
+BATT on Top Layer: 71.82,46.48 74.81,46.48 74.81,44.29 71.82,44.29
+BATT on Top Layer: 73.03,62.38 80.01,62.38 80.01,59.06 73.03,59.06
+BATT on Top Layer: 70.72,46.48 71.82,46.48 71.82,44.32 70.72,44.32
MGND on Top Layer: 36.1,76.54 50.42,76.54 50.42,61.68 36.1,61.68
MGND on Top Layer: 32.51,71.97 36.83,71.97 36.83,71.06 32.51,71.06
MGND on Top Layer: 49.02,70.23 56.24,70.23 56.24,66.02 49.02,66.02
MGND on Bottom Layer: 37.68,70.38 49.78,70.38 49.78,62.57 37.68,62.57
MGND on Bottom Layer: 32.77,76.29 39.96,76.29 39.96,69.11 32.77,69.11
POWER_GND on Top Layer: 61.9,72.09 76.5,72.09 76.5,57.23 61.9,57.23
POWER_GND on Top Layer: -1.91,93.09 100.33,93.09 100.33,-3.43 -1.91,-3.43
POWER_GND on Top Layer: 67.25,54.45 75.38,54.45 75.38,51.53 67.25,51.53
POWER_GND on Top Layer: 67.39,51.15 75.36,51.15 75.36,46.37 67.39,46.37
POWER_GND on Bottom Layer: 67.73,47.85 71.69,47.85 71.69,46.45 67.73,46.45
POWER_GND on Bottom Layer: 69.68,72.06 76.37,72.06 76.37,66.09 69.68,66.09
POWER_GND on Bottom Layer: -2.67,93.73 100.96,93.73 100.96,-3.3 -2.67,-3.3
POWER_GND on Bottom Layer: 62.53,68.76 70.12,68.76 70.12,62.31 62.53,62.31
POWER_GND on Bottom Layer: 72.84,50.98 75.5,50.98 75.5,46.83 72.84,46.83
$1N29 on Top Layer: 67.01,51.28 71.57,51.28 71.57,48.1 67.01,48.1
$1N12541 on Top Layer: 35.3,58.32 40.64,58.32 40.64,56.39 35.3,56.39
$1N35520 on Top Layer: 27.43,70.57 36.07,70.57 36.07,67.91 27.43,67.91
$1N36776 on Top Layer: 67.47,78.82 70.66,78.82 70.66,69.84 67.47,69.84

## Text on the board
Top Silkscreen Layer: XT60 connector we order would be like this / https://www.amazon.ca/RIIEYOCA-Connector-Extension-Quadcopter-XT60-male/dp/B09L62W679/ref=asc_df_B09L62W679?mcid=5ea187ce5ddb3fdd8b7d2b90c9799982&tag=googleshopc0c-20&linkCode=df0&hvadid=706743214245&hvpos=&hvnetw=g&hvrand=18416964478274017855&hvpone=&hvptwo=&hvqmt=&hvdev=c&hvdvcmdl=&hvlocint=&hvlocphy=9191846&hvtargid=pla-1730363463987&hvocijid=18416964478274017855-B09L62W679-&hvexpln=0&gad_source=1&th=1 | J5 -> XH / J6~J10 -> XH 2pin, and you can utilize bottom layer as well / lets try to follow the regulator pcb design as close to instructed | 3.3v 3 | RESET | SETUP
